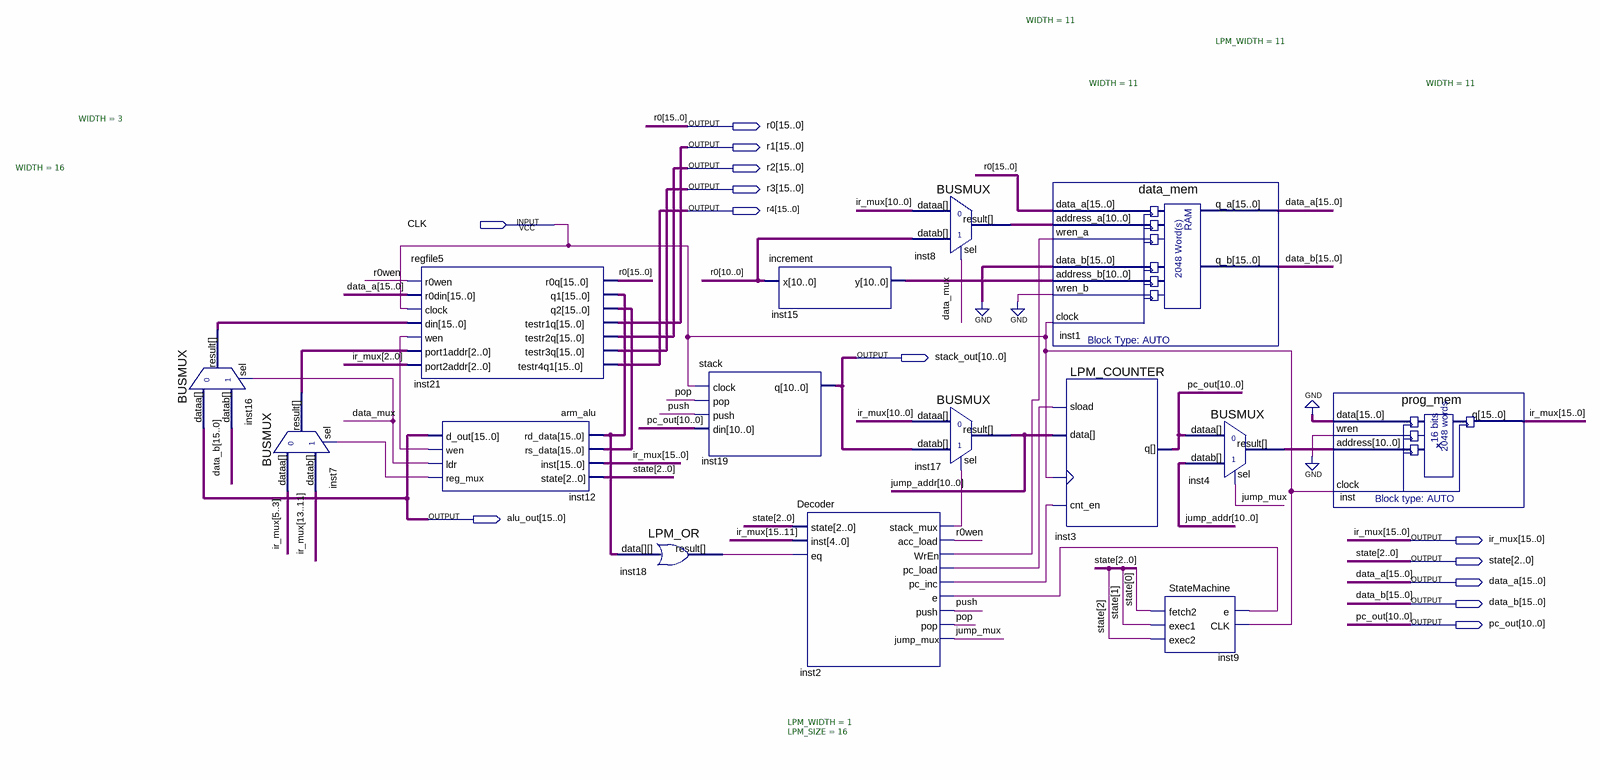
[diagram p0: schematic sheet]
// Quartus schematic HarvardArch.bdf as structural Verilog: 15 symbols, 13 pins
module HarvardArch (
  input  CLK,
  output [15:0] r0,
  output [15:0] r1,
  output [15:0] r2,
  output [15:0] r3,
  output [15:0] r4,
  output [10:0] stack_out,
  output [15:0] alu_out,
  output [15:0] ir_mux,
  output [2:0] state,
  output [15:0] data_a,
  output [15:0] data_b,
  output [10:0] pc_out
);

  wire data_mux, inst2_e, inst2_pc_inc, inst2_pc_load, inst2_stack_mux, inst2_wren, inst12_reg_mux,
       inst12_wen, inst18_result, jump_mux, pop, push, r0wen;
  wire [2:0] inst7_result;
  wire [10:0] inst4_result, inst8_result, inst15_y, jump_addr;
  wire [15:0] inst16_result, inst21_q1, inst21_q2;

  BUSMUX #(.WIDTH(16)) inst16 (.datab(data_b), .sel(data_mux), .dataa(alu_out), .result(inst16_result));
  BUSMUX #(.WIDTH(3)) inst7 (.datab(ir_mux[13:11]), .sel(inst12_reg_mux), .dataa(ir_mux[5:3]), .result(inst7_result));
  regfile5 inst21 (
    .r0wen(r0wen), .r0din(data_a), .clock(CLK), .din(inst16_result), .wen(inst12_wen),
    .port1addr(inst7_result), .port2addr(ir_mux[2:0]), .r0q(r0), .q1(inst21_q1), .q2(inst21_q2),
    .testr1q(r1), .testr2q(r2), .testr3q(r3), .testr4q1(r4));
  arm_alu inst12 (
    .rd_data(inst21_q1), .rs_data(inst21_q2), .inst(ir_mux), .state(state), .d_out(alu_out),
    .wen(inst12_wen), .ldr(data_mux), .reg_mux(inst12_reg_mux));
  LPM_OR #(.LPM_WIDTH(1), .LPM_SIZE(16)) inst18 (.data(inst21_q1), .result(inst18_result));
  stack inst19 (.clock(CLK), .pop(pop), .push(push), .din(pc_out), .q(stack_out));
  increment inst15 (.x(r0[10:0]), .y(inst15_y));
  Decoder inst2 (
    .state(state), .inst(ir_mux[15:11]), .eq(inst18_result), .stack_mux(inst2_stack_mux), .acc_load(r0wen),
    .WrEn(inst2_wren), .pc_load(inst2_pc_load), .pc_inc(inst2_pc_inc), .e(inst2_e), .push(push), .pop(pop),
    .jump_mux(jump_mux));
  BUSMUX #(.WIDTH(11)) inst8 (.datab(r0[10:0]), .sel(data_mux), .dataa(ir_mux[10:0]), .result(inst8_result));
  BUSMUX #(.WIDTH(11)) inst17 (.datab(stack_out), .sel(inst2_stack_mux), .dataa(ir_mux[10:0]), .result(jump_addr));
  data_mem inst1 (
    .data_a(r0), .address_a(inst8_result), .wren_a(inst2_wren), .data_b({16{1'b0}}), .address_b(inst15_y),
    .wren_b(1'b0), .clock(CLK), .q_a(data_a), .q_b(data_b));
  LPM_COUNTER #(.LPM_WIDTH(11)) inst3 (
    .sload(inst2_pc_load), .data(jump_addr), .clock(CLK), .cnt_en(inst2_pc_inc), .q(pc_out));
  BUSMUX #(.WIDTH(11)) inst4 (.datab(jump_addr), .sel(jump_mux), .dataa(pc_out), .result(inst4_result));
  StateMachine inst9 (.e(inst2_e), .CLK(CLK), .fetch2(state[0]), .exec1(state[1]), .exec2(state[2]));
  prog_mem inst (.data({16{1'b0}}), .wren(1'b0), .address(inst4_result), .clock(CLK), .q(ir_mux));
endmodule
